# Altium project Jog3K_Controller.PrjPCB
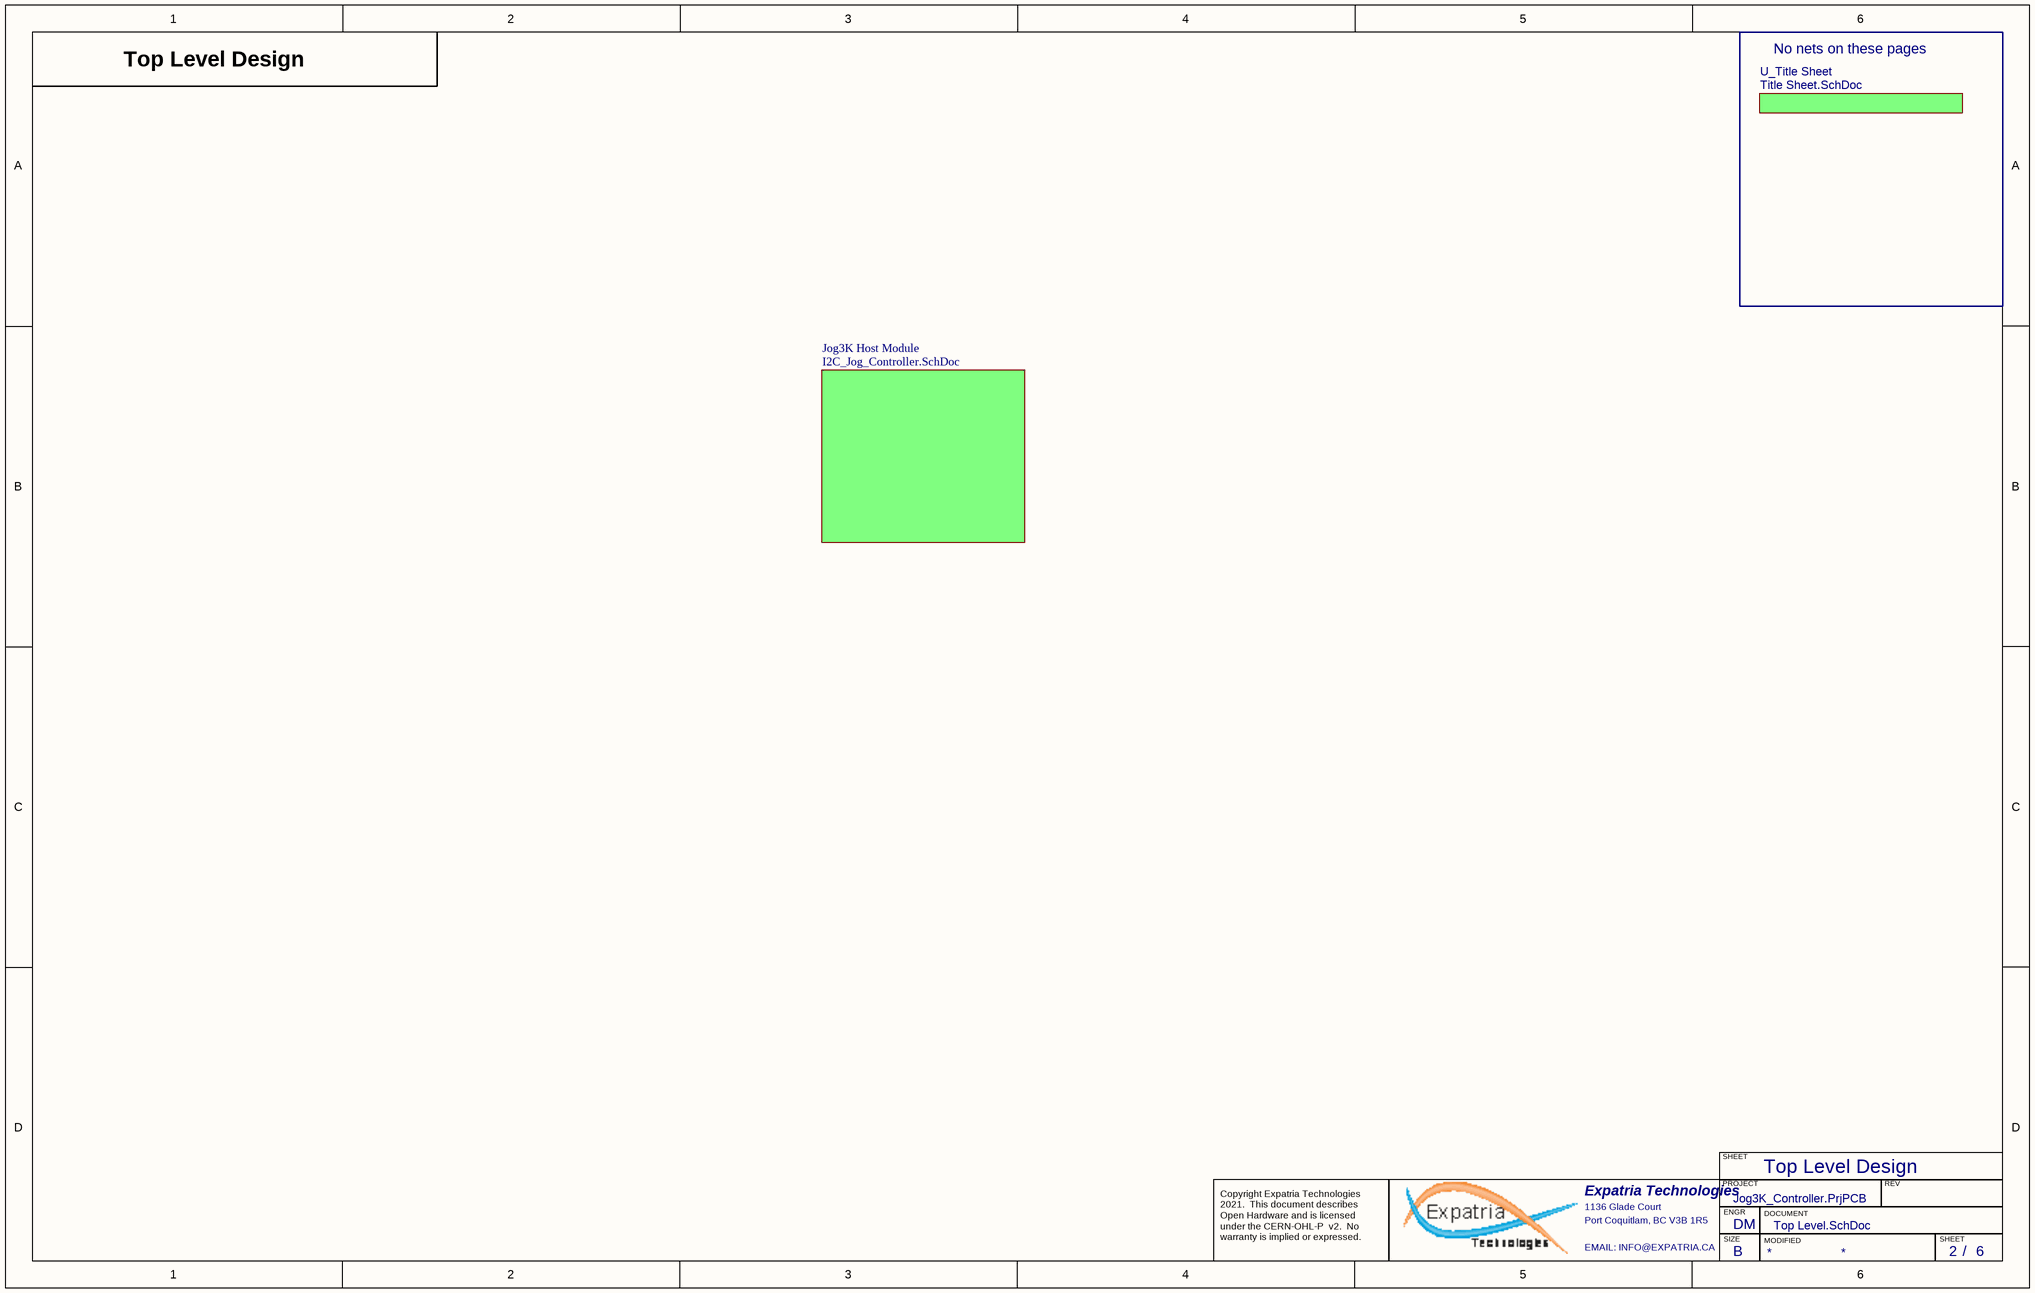
[diagram p0: Top Level.SchDoc]
VarRevNo: A3; Title: Jog3K; PCBREVNO: A3; PCBPARTNO: Jog3K
7 sheets, 150 parts. Net scope: hierarchical (ports join the sheet entries above them; power ports are global).
Board file: I2C_Jog_Controller.pcbdoc
Sheets:
  Top Level.SchDoc
    U_Title Sheet = Title Sheet.SchDoc
    Jog3K Host Module = I2C_Jog_Controller.SchDoc
      SL1 = PushButtonside.SchDoc
      LT = PushButtonQuadrant.SchDoc
      SL2 = PushButtonside.SchDoc
      UP = PushButtonQuadrant.SchDoc
      DN = PushButtonQuadrant.SchDoc
      RT = PushButtonQuadrant.SchDoc
      RI = PushButtonQuadrant.SchDoc
      LW = PushButtonQuadrant.SchDoc
      SPN = PushButtonBlack.SchDoc
      HME = PushButtonBlack.SchDoc
      SOVR = 12mm_rotary_knob.SchDoc
      FOVR = 12mm_rotary_knob.SchDoc
      FLD = PushButtonBlack.SchDoc
      MST = PushButtonBlack.SchDoc
      CYC = PushButtonBlack.SchDoc
      FHL = PushButtonBlack.SchDoc
      HLT = PushButtonBlack.SchDoc

## Sheet Top Level.SchDoc: Jog3K
size B; Author: DM; CompanyName: Silver Bullet Technology LLC; DrawnBy: D.McIntire; Engineer: DM; Organization: Silver Bullet Technology; Address1: Schematic; Address2: 5300 Via Andrea; Address3: Newbury Park, CA 91320; Address4: USA; DocumentNumber: 2; Revision: A3; SheetNumber: 2; SheetTotal: 6; PCB_Rev: A3

### Sub-sheets
Jog3K Host Module = I2C_Jog_Controller.SchDoc: no entries
U_Title Sheet = Title Sheet.SchDoc: no entries

### Notes on the sheet
- Top Level Design
- No nets on these pages
- SHEET
- Expatria Technologies
- 1136 Glade Court
- Port Coquitlam, BC V3B 1R5
- PROJECT
- SIZE
- ENGR
- MODIFIED
- DOCUMENT
- REV
- Copyright Expatria Technologies 2021.  This document describes Open Hardware and is licensed under the CERN-OHL-P  v2.  No warranty is implied or expressed.
- EMAIL: INFO@EXPATRIA.CA
- B
- /

## Sheet Title Sheet.SchDoc: Bluebell MFG PCB
size B; Author: AM; CompanyName: Cambridge Mobile Telematics; DrawnBy: A.Marles; Engineer: DM; Organization: Silver Bullet Technology; Address1: Schematic; Address2: 101 Main Street, 14th Floor; Address3: Cambridge, MA 02142; Address4: USA; DocumentNumber: 1; Revision: A3; SheetNumber: 1; SheetTotal: 6
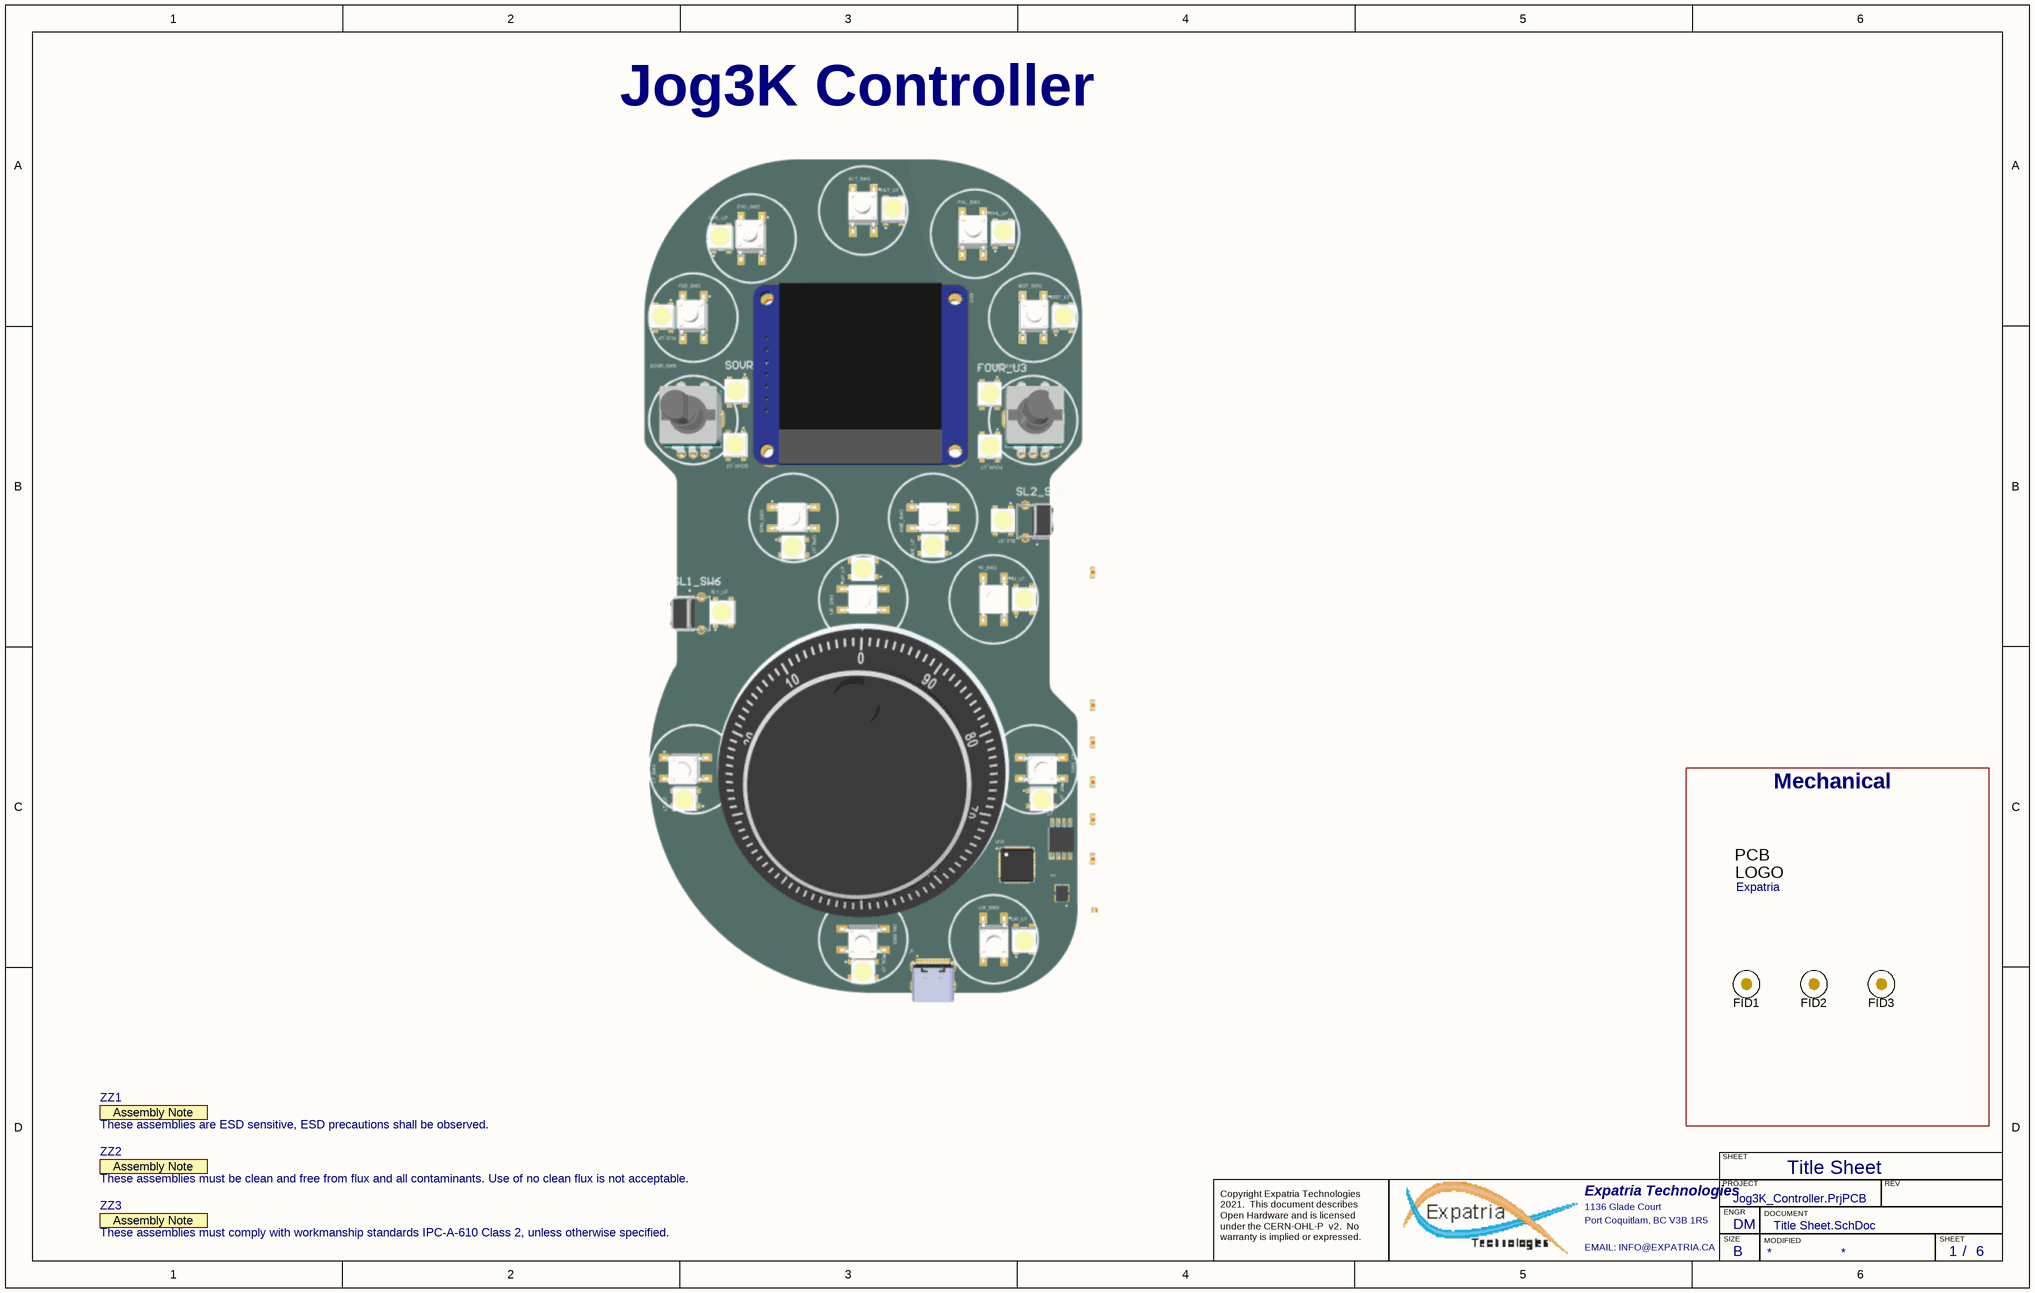
[diagram p1: Title Sheet.SchDoc]

### Parts
FID1  Fiducial  [Fiducial10-20]  (value not drawn)  (no BOM)
FID2  Fiducial  [Fiducial10-20]  (value not drawn)  (no BOM)
FID3  Fiducial  [Fiducial10-20]  (value not drawn)  (no BOM)
Logo1  Expatria  [Expatria-Logo]  (no BOM)
ZZ1  These assemblies are ESD sensitive, ESD precautions shall be observed.  [AssemblyNote]  (graphical)
ZZ2  These assemblies must be clean and free from flux and all contaminants. Use of no clean flux is not acceptable.  [AssemblyNote]  (graphical)
ZZ3  These assemblies must comply with workmanship standards IPC-A-610 Class 2, unless otherwise specified.  [AssemblyNote]  (graphical)

### Blocks framed on the sheet
Mechanical: FID1-FID3 Logo1

### Notes on the sheet
- Jog3K Controller
- Title Sheet
- SHEET
- Expatria Technologies
- 1136 Glade Court
- Port Coquitlam, BC V3B 1R5
- PROJECT
- SIZE
- ENGR
- MODIFIED
- DOCUMENT
- REV
- Copyright Expatria Technologies 2021.  This document describes Open Hardware and is licensed under the CERN-OHL-P  v2.  No warranty is implied or expressed.
- EMAIL: INFO@EXPATRIA.CA
- B
- /
- (in symbol AssemblyNote) Assembly Note
- (in symbol SBT-Logo) PCB; LOGO

### Library data of the parts
FID1-FID3 = Fiducial: FIDUCIAL NO ASSEMBLY; Manufacturer 1: NONE; Manufacturer Part Number 1: NONE; Value: Fiducial
Logo1 = SBT-Logo: Expatria Logo; Manufacturer 1: NONE; Value: SBT LOGO; Manufacturer Part Number 1: NONE
ZZ1-ZZ3 = AssemblyNote: SymbolCreator: codlsc; SymbolVersion: 2010-05-18; CompType: AssemblyNote; ClassName: AssemblyNote; Publisher: Texas Instruments; LatestRevisionDate: 2012-06-14; LatestRevisionNote: Initial Version; Alternate Manufacturer: -; Alternate PartNumber: -

## Sheet I2C_Jog_Controller.SchDoc: Bluebell MFG PCB
size C; Author: AM; CompanyName: Cambridge Mobile Telematics; DrawnBy: A.Marles; Engineer: DM; Organization: Silver Bullet Technology; Address1: Schematic; Address2: 101 Main Street, 14th Floor; Address3: Cambridge, MA 02142; Address4: USA; DocumentNumber: 3; Revision: A3; SheetNumber: 3; SheetTotal: 6
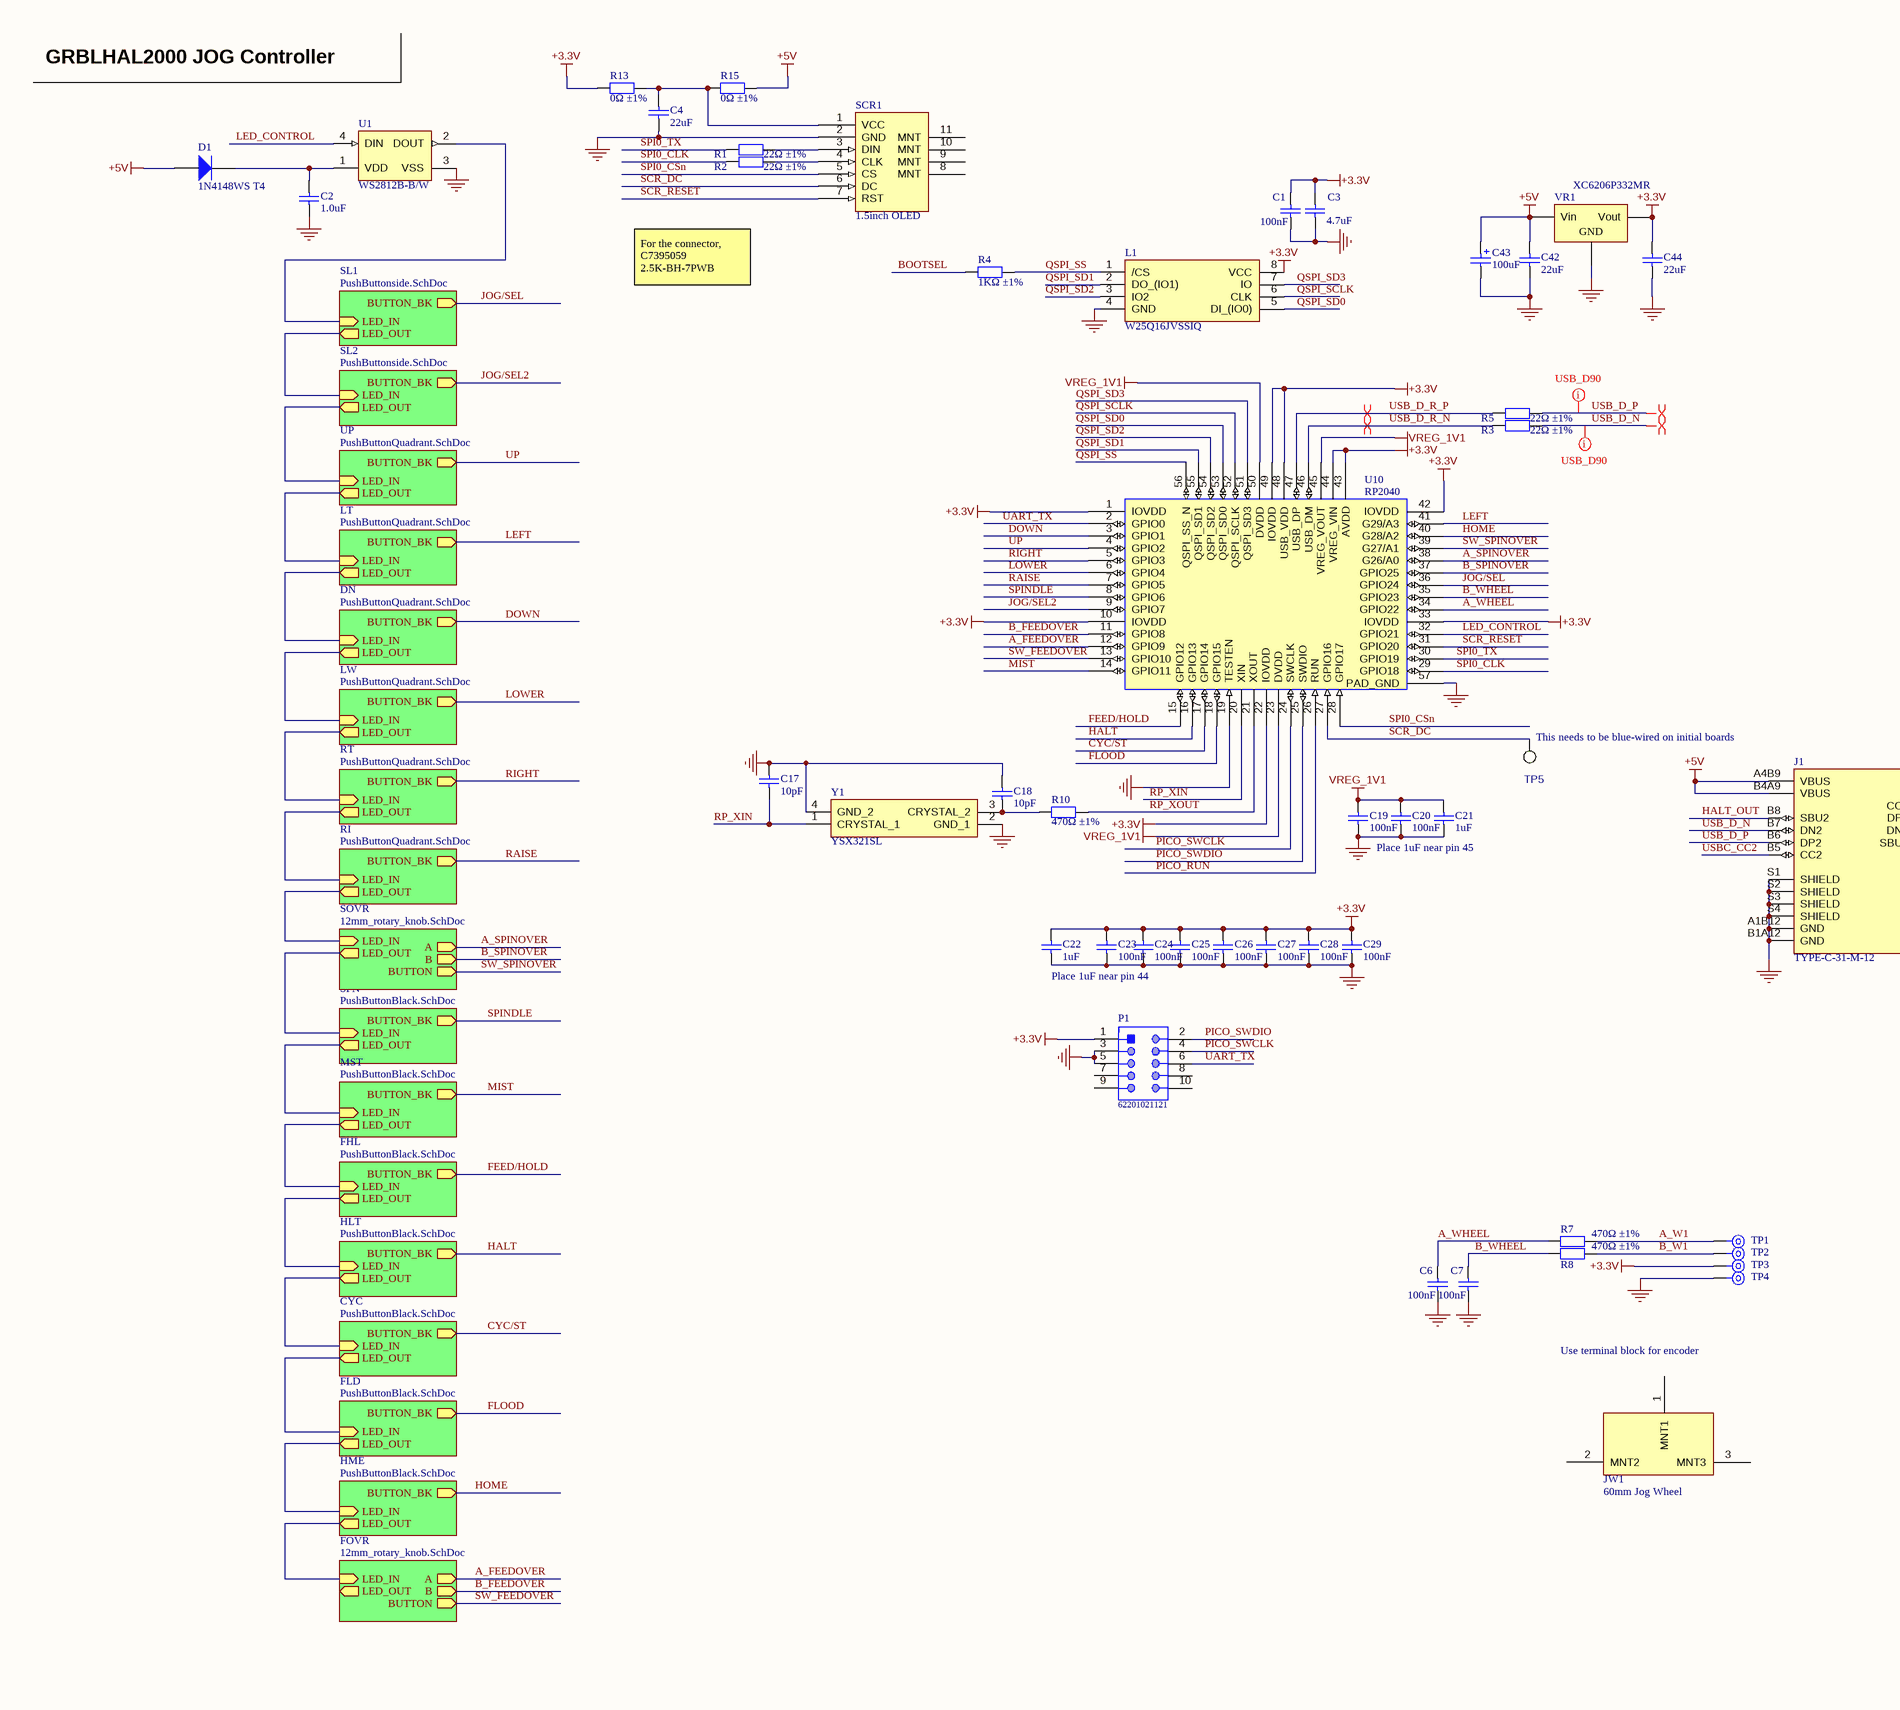
[diagram p2: I2C_Jog_Controller.SchDoc, left]
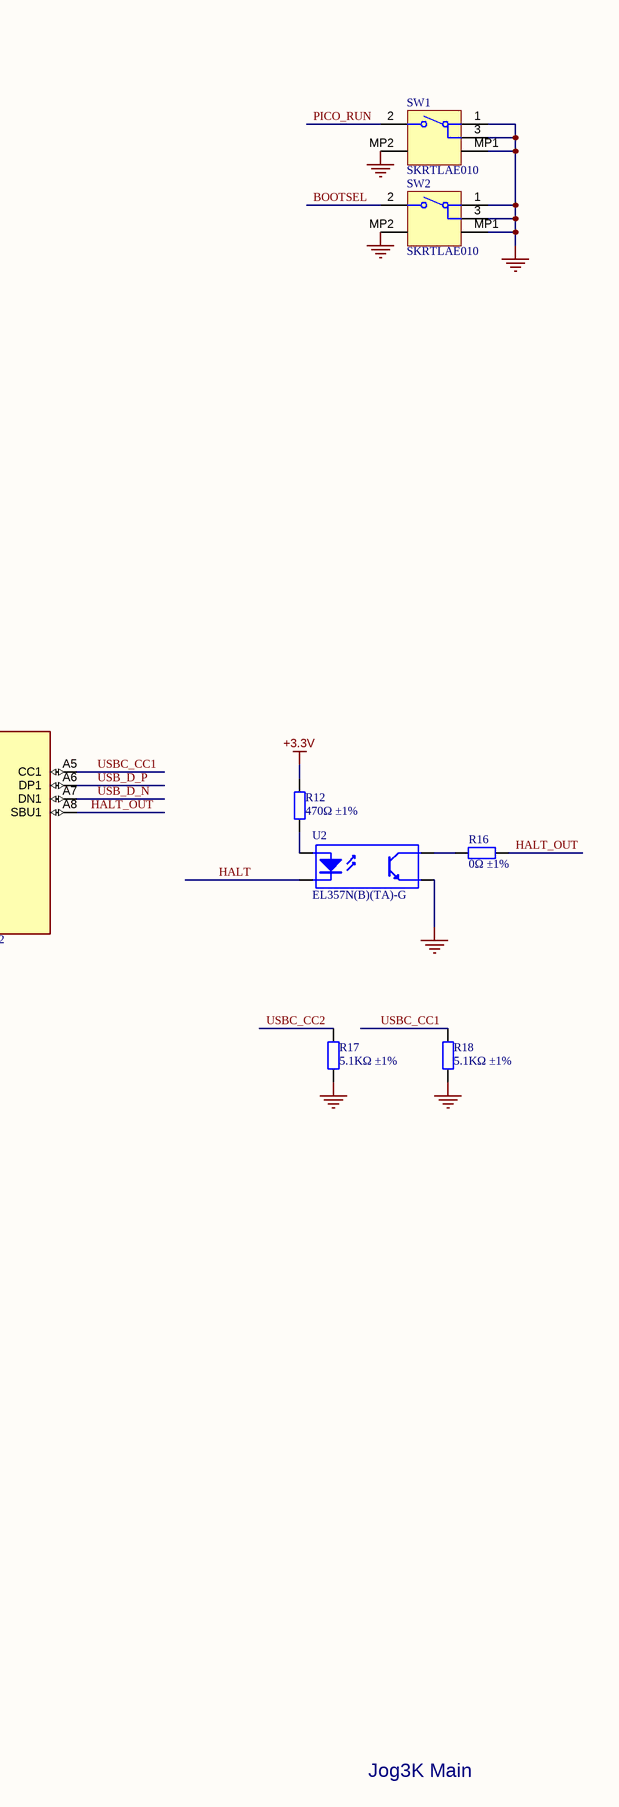
[diagram p3: I2C_Jog_Controller.SchDoc, right]

### Parts
C1  100nF  [0603_C]
C2  1.0uF  [0402_C]
C3  4.7uF  [0603_C]
C4  22uF  [0805_C]
C6  100nF  [0603_C]
C7  100nF  [0603_C]
C17  10pF  [0603_C]
C18  10pF  [0603_C]
C19  100nF  [0603_C]
C20  100nF  [0603_C]
C21  1uF  [0603_C]
C22  1uF  [0603_C]
C23  100nF  [0603_C]
C24  100nF  [0603_C]
C25  100nF  [0603_C]
C26  100nF  [0603_C]
C27  100nF  [0603_C]
C28  100nF  [0603_C]
C29  100nF  [0603_C]
C42  22uF  [0805_C]
C43  100uF  [CASE-B_3528]
C44  22uF  [0805_C]
D1  1N4148WS T4  [SOD-323]
J1  TYPE-C-31-M-12  [HRO_TYPE-C-31-M-12]
JW1  60mm Jog Wheel  [60mm_Jog_wheel]
L1  W25Q16JVSSIQ  [SOIC127P780X195-8N]
P1  62201021121  [62201021121]  (no BOM)
R1  22Ω ±1%  [0603_R]
R2  22Ω ±1%  [0603_R]
R3  22Ω ±1%  [0603_R]
R4  1KΩ ±1%  [0603_R]
R5  22Ω ±1%  [0603_R]
R7  470Ω ±1%  [0603_R]
R8  470Ω ±1%  [0603_R]
R10  470Ω ±1%  [0603_R]
R12  470Ω ±1%  [0603_R]
R13  0Ω ±1%  [0603_R]
R15  0Ω ±1%  [0603_R]  (no BOM)
R16  0Ω ±1%  [0603_R]  (no BOM)
R17  5.1KΩ ±1%  [0603_R]
R18  5.1KΩ ±1%  [0603_R]
SCR1  1.5inch OLED  [1.5inch_Waveshare_OLED]  (no BOM)
SW1  SKRTLAE010  [ALPS-SKRTLAE010_V]
SW2  SKRTLAE010  [ALPS-SKRTLAE010_V]
TP1  2.5mm TP  [TP_SQ_2.5mm]  (value not drawn)  (no BOM)
TP2  2.5mm TP  [TP_SQ_2.5mm]  (value not drawn)  (no BOM)
TP3  2.5mm TP  [TP_SQ_2.5mm]  (value not drawn)  (no BOM)
TP4  2.5mm TP  [TP_SQ_2.5mm]  (value not drawn)  (no BOM)
TP5  TESTPOINT  [TP/SMALL]  (value not drawn)  (no BOM)
U1  WS2812B-B/W  [ADA-RGB-1655_V]
U2  EL357N(B)(TA)-G  [SOP-4_P2.54]
U10  RP2040  [RP2040]
VR1  XC6206P332MR  [SOT-23-3L]
Y1  YSX321SL  [YSX321SL]

### Sub-sheets
CYC = PushButtonBlack.SchDoc: BUTTON_BK (out), LED_IN (in), LED_OUT (out)
DN = PushButtonQuadrant.SchDoc: BUTTON_BK (out), LED_OUT (out), LED_IN (in)
FHL = PushButtonBlack.SchDoc: BUTTON_BK (out), LED_IN (in), LED_OUT (out)
FLD = PushButtonBlack.SchDoc: BUTTON_BK (out), LED_OUT (out), LED_IN (in)
FOVR = 12mm_rotary_knob.SchDoc: LED_OUT (out), LED_IN (in), A (out), B (out), BUTTON (out)
HLT = PushButtonBlack.SchDoc: BUTTON_BK (out), LED_IN (in), LED_OUT (out)
HME = PushButtonBlack.SchDoc: BUTTON_BK (out), LED_IN (in), LED_OUT (out)
LT = PushButtonQuadrant.SchDoc: BUTTON_BK (out), LED_IN (in), LED_OUT (out)
LW = PushButtonQuadrant.SchDoc: BUTTON_BK (out), LED_OUT (out), LED_IN (in)
MST = PushButtonBlack.SchDoc: BUTTON_BK (out), LED_OUT (out), LED_IN (in)
RI = PushButtonQuadrant.SchDoc: BUTTON_BK (out), LED_OUT (out), LED_IN (in)
RT = PushButtonQuadrant.SchDoc: BUTTON_BK (out), LED_IN (in), LED_OUT (out)
SL1 = PushButtonside.SchDoc: BUTTON_BK (out), LED_OUT (out), LED_IN (in)
SL2 = PushButtonside.SchDoc: BUTTON_BK (out), LED_OUT (out), LED_IN (in)
SOVR = 12mm_rotary_knob.SchDoc: LED_OUT (out), LED_IN (in), A (out), B (out), BUTTON (out)
SPN = PushButtonBlack.SchDoc: BUTTON_BK (out), LED_IN (in), LED_OUT (out)
UP = PushButtonQuadrant.SchDoc: BUTTON_BK (out), LED_IN (in), LED_OUT (out)

### Nets
+3.3V: C1.2 C3.2 C22.2 C23.2 C24.2 C25.2 C26.2 C27.2 C28.2 C29.2 C44.2 L1.8(VCC) P1.1 R12.2 R13.2 TP3.1 U10.1(IOVDD) U10.10(IOVDD) U10.22(IOVDD) U10.33(IOVDD) U10.42(IOVDD) U10.43(AVDD) U10.44(VREG_VIN) U10.48(USB_VDD) U10.49(IOVDD) VR1.2(Vout)
+5V: C42.2 C43.1 D1.1(A) J1.A4B9(VBUS) J1.B4A9(VBUS) R15.1 VR1.3(Vin)
GND: C1.1 C2.1 C3.1 C4.1 C6.1 C7.1 C17.2 C18.2 C19.1 C20.1 C21.1 C22.1 C23.1 C24.1 C25.1 C26.1 C27.1 C28.1 C29.1 C42.1 C43.2 C44.1 J1.A1B12(GND) J1.B1A12(GND) J1.S1(SHIELD) J1.S2(SHIELD) J1.S3(SHIELD) J1.S4(SHIELD) L1.4(GND) P1.3 P1.5 R17.2 R18.2 SCR1.2(GND) SW1.1 SW1.3 SW1.MP1 SW1.MP2 SW2.1 SW2.3 SW2.MP1 SW2.MP2 TP4.1 U1.3(VSS) U2.3(E) U10.19(TESTEN) U10.57(PAD_GND) VR1.1(GND) Y1.2(GND_1) Y1.4(GND_2)
VREG_1V1: C19.2 C20.2 C21.2 U10.23(DVDD) U10.45(VREG_VOUT) U10.50(DVDD)
A_FEEDOVER: U10.12(GPIO9) ; sheet FOVR/A
A_SPINOVER: U10.38(G26/A0) ; sheet SOVR/A
A_W1: R7.2 TP1.1
A_WHEEL: C6.2 R7.1 U10.34(GPIO22)
B_FEEDOVER: U10.11(GPIO8) ; sheet FOVR/B
B_SPINOVER: U10.37(GPIO25) ; sheet SOVR/B
B_W1: R8.2 TP2.1
B_WHEEL: C7.2 R8.1 U10.35(GPIO23)
BOOTSEL: R4.1 SW2.2
CYC/ST: U10.17(GPIO14) ; sheet CYC/BUTTON_BK
DOWN: U10.3(GPIO1) ; sheet DN/BUTTON_BK
FEED/HOLD: U10.15(GPIO12) ; sheet FHL/BUTTON_BK
FLOOD: U10.18(GPIO15) ; sheet FLD/BUTTON_BK
HALT: U2.2(K) U10.16(GPIO13) ; sheet HLT/BUTTON_BK
HALT_OUT: J1.A8(SBU1) J1.B8(SBU2) R16.1
HOME: U10.40(G28/A2) ; sheet HME/BUTTON_BK
JOG/SEL: U10.36(GPIO24) ; sheet SL1/BUTTON_BK
JOG/SEL2: U10.9(GPIO7) ; sheet SL2/BUTTON_BK
LED_CONTROL: U1.4(DIN) U10.32(GPIO21)
LED_IN: U1.2(DOUT) ; sheet SL1/LED_OUT, sheet SL1/LED_IN, sheet SL2/LED_OUT, sheet SL2/LED_IN, sheet UP/LED_IN
LED_IN: sheet LT/LED_OUT, sheet DN/LED_IN  [a separate net that carries the same name]
LED_IN: sheet LT/LED_IN, sheet UP/LED_OUT  [a separate net that carries the same name]
LED_IN: sheet DN/LED_OUT, sheet LW/LED_IN  [a separate net that carries the same name]
LED_IN: sheet RT/LED_OUT, sheet RI/LED_IN  [a separate net that carries the same name]
LED_IN: sheet RT/LED_IN, sheet LW/LED_OUT  [a separate net that carries the same name]
LED_IN: sheet RI/LED_OUT, sheet SOVR/LED_IN  [a separate net that carries the same name]
LED_IN: sheet SPN/LED_OUT, sheet MST/LED_IN  [a separate net that carries the same name]
LED_IN: sheet SPN/LED_IN, sheet SOVR/LED_OUT  [a separate net that carries the same name]
LED_IN: sheet HME/LED_OUT, sheet FOVR/LED_IN  [a separate net that carries the same name]
LED_IN: sheet HME/LED_IN, sheet FLD/LED_OUT  [a separate net that carries the same name]
LED_IN: sheet FLD/LED_IN, sheet CYC/LED_OUT  [a separate net that carries the same name]
LED_IN: sheet MST/LED_OUT, sheet FHL/LED_IN  [a separate net that carries the same name]
LED_IN: sheet CYC/LED_IN, sheet HLT/LED_OUT  [a separate net that carries the same name]
LED_IN: sheet FHL/LED_OUT, sheet HLT/LED_IN  [a separate net that carries the same name]
LEFT: U10.41(G29/A3) ; sheet LT/BUTTON_BK
LOWER: U10.6(GPIO4) ; sheet LW/BUTTON_BK
MIST: U10.14(GPIO11) ; sheet MST/BUTTON_BK
PICO_RUN: SW1.2 U10.26(RUN)
PICO_SWCLK: P1.4 U10.24(SWCLK)
PICO_SWDIO: P1.2 U10.25(SWDIO)
QSPI_SCLK: L1.6(CLK) U10.52(QSPI_SCLK)
QSPI_SD0: L1.5(DI_(IO0)) U10.53(QSPI_SD0)
QSPI_SD1: L1.2(DO_(IO1)) U10.55(QSPI_SD1)
QSPI_SD2: L1.3(IO2) U10.54(QSPI_SD2)
QSPI_SD3: L1.7(IO) U10.51(QSPI_SD3)
QSPI_SS: L1.1(/CS) R4.2 U10.56(QSPI_SS_N)
RAISE: U10.7(GPIO5) ; sheet RI/BUTTON_BK
RIGHT: U10.5(GPIO3) ; sheet RT/BUTTON_BK
RP_XIN: C17.1 U10.20(XIN) Y1.1(CRYSTAL_1)
RP_XOUT: R10.2 U10.21(XOUT)
SCR_DC: SCR1.6(DC) TP5.1 U10.27(GPIO16)
SCR_RESET: SCR1.7(RST) U10.31(GPIO20)
SPI0_CLK: R2.2 U10.29(GPIO18)
SPI0_CSn: SCR1.5(CS) U10.28(GPIO17)
SPI0_TX: R1.2 U10.30(GPIO19)
SPINDLE: U10.8(GPIO6) ; sheet SPN/BUTTON_BK
SW_FEEDOVER: U10.13(GPIO10) ; sheet FOVR/BUTTON
SW_SPINOVER: U10.39(G27/A1) ; sheet SOVR/BUTTON
UART_TX: P1.6 U10.2(GPIO0)
UP: U10.4(GPIO2) ; sheet UP/BUTTON_BK
USB_D_N: J1.A7(DN1) J1.B7(DN2) R3.1
USB_D_P: J1.A6(DP1) J1.B6(DP2) R5.1
USB_D_R_N: R3.2 U10.46(USB_DM)
USB_D_R_P: R5.2 U10.47(USB_DP)
USBC_CC1: J1.A5(CC1) R18.1
USBC_CC2: J1.B5(CC2) R17.1
NetC2_2: C2.2 D1.2(K) U1.1(VDD)
NetC4_2: C4.2 R13.1 R15.2 SCR1.1(VCC)
NetC18_1: C18.1 R10.1 Y1.3(CRYSTAL_2)
NetR1_1: R1.1 SCR1.3(DIN)
NetR2_1: R2.1 SCR1.4(CLK)
NetR12_1: R12.1 U2.1(A)
NetR16_2: R16.2 U2.4(C)

Not connected (* = marked no-connect by the designer): JW1 1(MNT1) 2(MNT2) 3(MNT3); P1 7 8 9 10; SCR1 8(MNT) 9(MNT) 10(MNT) 11(MNT)

### Layout directives
differential pair: USB_D_N, USB_D_P, USB_D_R_N, USB_D_R_P
net class USB_D90: USB_D_N, USB_D_P

### Notes on the sheet
- GRBLHAL2000 JOG Controller
- For the connector,
  C7395059
  2.5K-BH-7PWB
- (near TP5) This needs to be blue-wired on initial boards
- Place 1uF near pin 45
- Place 1uF near pin 44
- Use terminal block for encoder
- Jog3K Main
- Expatria Technologies
- SHEET
- PROJECT
- REV
- 1136 Glade Court
- Port Coquitlam, BC V3B 1R5
- EMAIL: INFO@EXPATRIA.CA
- SIZE
- ENGR
- C
- MODIFIED
- DOCUMENT
- /
- Copyright Expatria Technologies 2021.  This document describes Open Hardware and is licensed under the CERN-OHL-P  v2.  No warranty is implied or expressed.

### Library data of the parts
C1 C6 C7 C19 C20 C23-C29 = 0603 100nF (104) 10% 50V: Chip capacitors; Manufacturer: YAGEO; PartNumber: CC0603KRX7R9BB104; Tolerance: 10%; Voltage: 50V; ComponentLink1Description: Supplier link; ComponentLink1URL: http://www.szlcsc.com/product/details_15331.html; Package: 0603; Supplier: LC; SuppliersPartNumber: C14663; Capacitance: 100nF
C2 = 0402 1.0uF (105) 10% 25V: Chip capacitor; Manufacturer: Samsung Electro-Mechanics; PartNumber: CL05A105KA5NQNC; Capacitance: 1uF; Tolerance: 10%; Voltage: 25V; ComponentLink1Description: Supplier link; ComponentLink1URL: http://www.szlcsc.com/product/details_53938.html; Package: 0402; Supplier: LC; SuppliersPartNumber: C52923
C3 = 0603 4.7uF (475) 10% 16V: Chip capacitors; Manufacturer: Samsung Electro-Mechanics; PartNumber: CL10A475KO8NNNC; Tolerance: 10%; Voltage: 16V; ComponentLink1Description: Supplier link; ComponentLink1URL: http://www.szlcsc.com/product/details_20375.html; Package: 0603; Supplier: LC; SuppliersPartNumber: C19666; Capacitance: 4.7uF
C4 C42 C44 = 0805 22uF (226) 20% 25V: Chip capacitors; Manufacturer: Samsung Electro-Mechanics; PartNumber: CL21A226MAQNNNE; Tolerance: 20%; Voltage: 25V; ComponentLink1Description: Supplier link; ComponentLink1URL: http://www.szlcsc.com/product/details_46786.html; Package: 0805; Supplier: LC; SuppliersPartNumber: C45783; Capacitance: 22uF
C17 C18 = 0603 10pF (100) 5% 50V: Chip capacitors; Manufacturer: Samsung Electro-Mechanics; PartNumber: CL10C100JB8NNNC; Tolerance: 5%; Voltage: 50V; ComponentLink1Description: Supplier link; ComponentLink1URL: http://www.szlcsc.com/product/details_1986.html; Package: 0603; Supplier: LC; SuppliersPartNumber: C1634; Capacitance: 10pF
C21 C22 = 0603 1uF (105) 10% 50V: Chip capacitors; Manufacturer: Samsung Electro-Mechanics; PartNumber: CL10A105KB8NNNC; Tolerance: 10%; Voltage: 50V; ComponentLink1Description: Supplier link; ComponentLink1URL: http://www.szlcsc.com/product/details_16531.html; Package: 0603; Supplier: LC; SuppliersPartNumber: C15849; Capacitance: 1uF
C43 = 3528 100uF (107) 10% 6.3V: Tantalum capacitor; Manufacturer: AVX; PartNumber: TAJB107K006RNJ; Tolerance: 10%; Voltage: 6.3V; ComponentLink1Description: Supplier link; ComponentLink1URL: http://www.szlcsc.com/product/details_16815.html; Package: 3528; Supplier: LC; SuppliersPartNumber: C16133; Capacitance: 100uF
D1 = SOD-323 1N4148WS T4: 二极管; ComponentLink1Description: 供应商链接; ComponentLink1URL: http://www.szlcsc.com/product/details_2485.html; Package: SOD-323; Supplier: LC; SuppliersPartNumber: C2128
J1 = TYPE-C-31-M-12: USB Connectors 24 Receptacle 1 8.94*7.3mm RoHS; MF: HRO Electronics Co., Ltd.; Value: *; SnapEDA_Link: https://www.snapeda.com/parts/TYPE-C-31-M-12/HRO%20Electronics%20Co.,%20Ltd./view-part/3228496/?ref=snap; Package: Package; MP: TYPE-C-31-M-12; Price: None; Availability: Unavailable; SuppliersPartNumber: C165948
JW1 = 60mm_Jog_Wheel
L1 = W25Q128JVSIQ_TR: SPI NOR FLASH 16Mbit; Manufacturer_Name: Winbond; Datasheet Link: http://www.winbond.com/resource-files/w25q128jv%20spi%20revc%2011162016.pdf; Height: 1.95mm; Manufacturer_Part_Number: W25Q16JVSSIQ; SuppliersPartNumber: C82317
P1 = CMP-1502-00948-1: THT Vertical Pin Header WR-PHD, Pitch 1.27 mm, Dual Row, 10 pins; Manufacturer: Wurth Elektronik; Rated Current: 1A; Pin Number: 10; Working Voltage: 100VAC; Contact Resistance: 20mOhm; Withstanding Voltage: 500VAC; Pitch: 1.27mm; Gender: Male; Mounting Technology: THT; Manufacturer URL: http://www.we-online.de; Package Reference: 62201021121; Row Number: Dual; Datasheet URL: https://katalog.we-online.de/em/datasheet/62201021121.pdf; Publisher: WurthElektronik; Packaging: Box; Operating Temperature: -40to105degC; Orientation: Vertical; Part Number: 62201021121
R1-R3 R5 = 0603 22R (22R0) 1%: Chip resistor; Manufacturer: Uniroyal Elec; PartNumber: 0603WAF220JT5E; Power: 1/10W; ComponentLink1Description: Supplier link; ComponentLink1URL: http://www.szlcsc.com/product/details_24078.html; Package: 0603; Supplier: LC; SuppliersPartNumber: C23345; Resistance: 22Ω; Tolerance: 1%
R4 = 0603 1K (1001) 1%: Chip resistor; Manufacturer: Uniroyal Elec; PartNumber: 0603WAF1001T5E; Power: 1/10W; ComponentLink1Description: Supplier link; ComponentLink1URL: http://www.szlcsc.com/product/details_21904.html; Package: 0603; Supplier: LC; SuppliersPartNumber: C21190; Resistance: 1KΩ; Tolerance: 1%
R7 R8 R10 R12 = 0603 470R (4700) 1%: Chip resistor; Manufacturer: Uniroyal Elec; PartNumber: 0603WAF4700T5E; Power: 1/10W; ComponentLink1Description: Supplier link; ComponentLink1URL: http://www.szlcsc.com/product/details_23906.html; Package: 0603; Supplier: LC; SuppliersPartNumber: C23179; Resistance: 470Ω; Tolerance: 1%
R13 R15 R16 = 0603 0R (0R0) 1%: Chip resistor; Manufacturer: Uniroyal Elec; PartNumber: 0603WAF0000T5E; Power: 1/10W; ComponentLink1Description: Supplier link; ComponentLink1URL: http://www.szlcsc.com/product/details_21903.html; Package: 0603; Supplier: LC; SuppliersPartNumber: C21189; Resistance: 0Ω; Tolerance: 1%
R17 R18 = 0603 5.1K (5101) 1%: Chip resistor; Manufacturer: Uniroyal Elec; PartNumber: 0603WAF5101T5E; Power: 1/10W; ComponentLink1Description: Supplier link; ComponentLink1URL: http://www.szlcsc.com/product/details_23913.html; Package: 0603; Supplier: LC; SuppliersPartNumber: C23186; Resistance: 5.1KΩ; Tolerance: 1%
SCR1 = 1.5inch Waveshare OLED screen: SuppliersPartNumber: C2897370
SW1 SW2 = CMP-2000-07073-2: Side Push Type, 250 V, -40 to 90 degC, 3-Pin SMD, RoHS, Tape and Reel; Manufacturer: ALPS; Operating Force: 1.6N; Folder: Unified Components\Components\New Releases\New\; Maximum Current Rating: 0.05@12VDCA; RevisionId: 1; Pole Throw Configuration: SPST; Switch Configuration: N.O.; AccessRights: 2147483647; Maximum DC Voltage Rating: 12V; ContentType: Unified Component; Rad Hard: No; Mounting: SurfaceMount; Datasheet URL: http://www.alps.com/prod/info/E/PDF/Tact/SurfaceMount/SKRT/SKRT.PDF; Manufacturer URL: http://www.alps.com/e/; ReleaseDate: 22/09/2017 06:13:25 AM; ItemHRID: CMP-2000-07073; ContentTypeGUID: CB3C11C4-E317-11DF-B822-12313F0024A2; LifeCycle: Released; ItemGUID: EAC55BEC-37DC-4BDB-8BA7-D75E6D5C3D75; Packaging: Tape&Reel; Package Reference: SKRTLAE010; FolderGUID: B7F4506A-9127-42E7-A087-46FE7B18D116; Datasheet Version: 06/2015; Mounting Technology: SurfaceMount; LifeCycleStateGUID: 61E382EE-6656-4F12-9E24-BE9327104A25; Package Description: 3-Pin Surface Mount Device, Body 4.5 x 3.55 mm, Pitch 1.225 mm; SuppliersPartNumber: C110293; Manufacturer 1: ALPS
TP1-TP4 = TL_5017: 2.5mm x 3.5mm pad; Manufacturer 1: Keystone Electronics; Manufacturer Part Number 1: 5017; Number of Ports: 1; Value: Test Loop; Supplier 1: Digi-Key; Supplier Part Number 1: 36-5017CT-ND; Stock 1: 203311; Pricing 1: 1 = 0.47000, 10 = 0.44100, 25 = 0.37800, 50 = 0.32140, 100 = 0.30880, 250 = 0.27732, 500 = 0.26472, 1000 = 0.22061, 2500 = 0.20170 (USD); RoHS: Yes; Mount: Surface Mount; Color: White; Contact Plating: Tin; Contact Material: Bronze; Material: Bronze; Package Quantity: 5000; Packaging: Tape and Reel; Termination: Solder; Orientation: Straight; Length: 2.66mm; Depth: 1.01mm; REACH SVHC: No SVHC; Lead Free: Lead Free; ComponentLink1URL: https://datasheet.ciiva.com/18456/5017-18456885.pdf?src-supplier=Digi-Key; ComponentLink1Description: https://datasheet.ciiva.com/18456/5017-18456885.pdf?src-supplier=Digi-Key; ComponentLink2URL: https://datasheet.ciiva.com/18456/5017-18456886.pdf?src-supplier=Digi-Key; ComponentLink2Description: https://datasheet.ciiva.com/18456/5017-18456886.pdf?src-supplier=Digi-Key; ComponentLink3URL: https://datasheet.ciiva.com/18456/5017-18456887.pdf?src-supplier=Digi-Key; ComponentLink3Description: https://datasheet.ciiva.com/18456/5017-18456887.pdf?src-supplier=Digi-Key
TP5 = TESTPOINT: Test Point; Manufacturer 1: N/A; Manufacturer Part Number 1: N/A; Value: Testpoint; Manufacturer: N/A; Manufacturer Part Number: N/A
U1 = CMP-2000-05026-1: Intelligent Control LED Integrated Light Source, 3.5 to 5.3 V, -25 to 80 degC, 4-Pin SMD, RoHS, Tape and Reel; Manufacturer: Worldsemi; Package Description: 4-Pin Surface Mount Device, Body 5 x 5 mm; SuppliersPartNumber: C2874885; Part_Number: WS2812B-B/W
U2 = EL357N(B)(TA)-G_[C6649]: OPTOISOLATOR 3.75KV TRANS 4-SOP; Manufacturer 1: Everlight Elec; ComponentLink1Description: 供应商链接; ComponentLink1URL: http://www.szlcsc.com/product/details_7114.html; Package: SOP-4_P2.54; Supplier: LC; SuppliersPartNumber: C6649; Manufacturer Part Number 1: EL357N(B)(TA)-G
U10 = RP2040: RP2040 First MCU from RPI
VR1 = SOT-23 XC6206P332MR: 200mA 680mV@(100mA) Fixed 3.3V~3.3V Positive 1 6V SOT-23-3L Linear Voltage Regulators (LDO) ROHS; ComponentLink1Description: 供应商链接; ComponentLink1URL: http://www.szlcsc.com/product/details_5896.html; Package: SOT-23; Supplier: LC; SuppliersPartNumber: C5446
Y1 = YSX321SL: Crystal or Oscillator; Manufacturer_Name: YXC; Datasheet Link: https://datasheet.lcsc.com/szlcsc/YSX321SL-30MHZ-10PF-8PPM_C70576.pdf; Height: 0.8mm; Manufacturer_Part_Number: YSX321SL; SuppliersPartNumber: C9002

## Sheet PushButtonside.SchDoc: Jog3K
size B; DocumentNumber: 5; SheetNumber: 5; SheetTotal: 6
Used 2 times, as channels Jog3K Host Module/SL1, Jog3K Host Module/SL2. Parts and nets are listed once, with the designators drawn on the sheet.
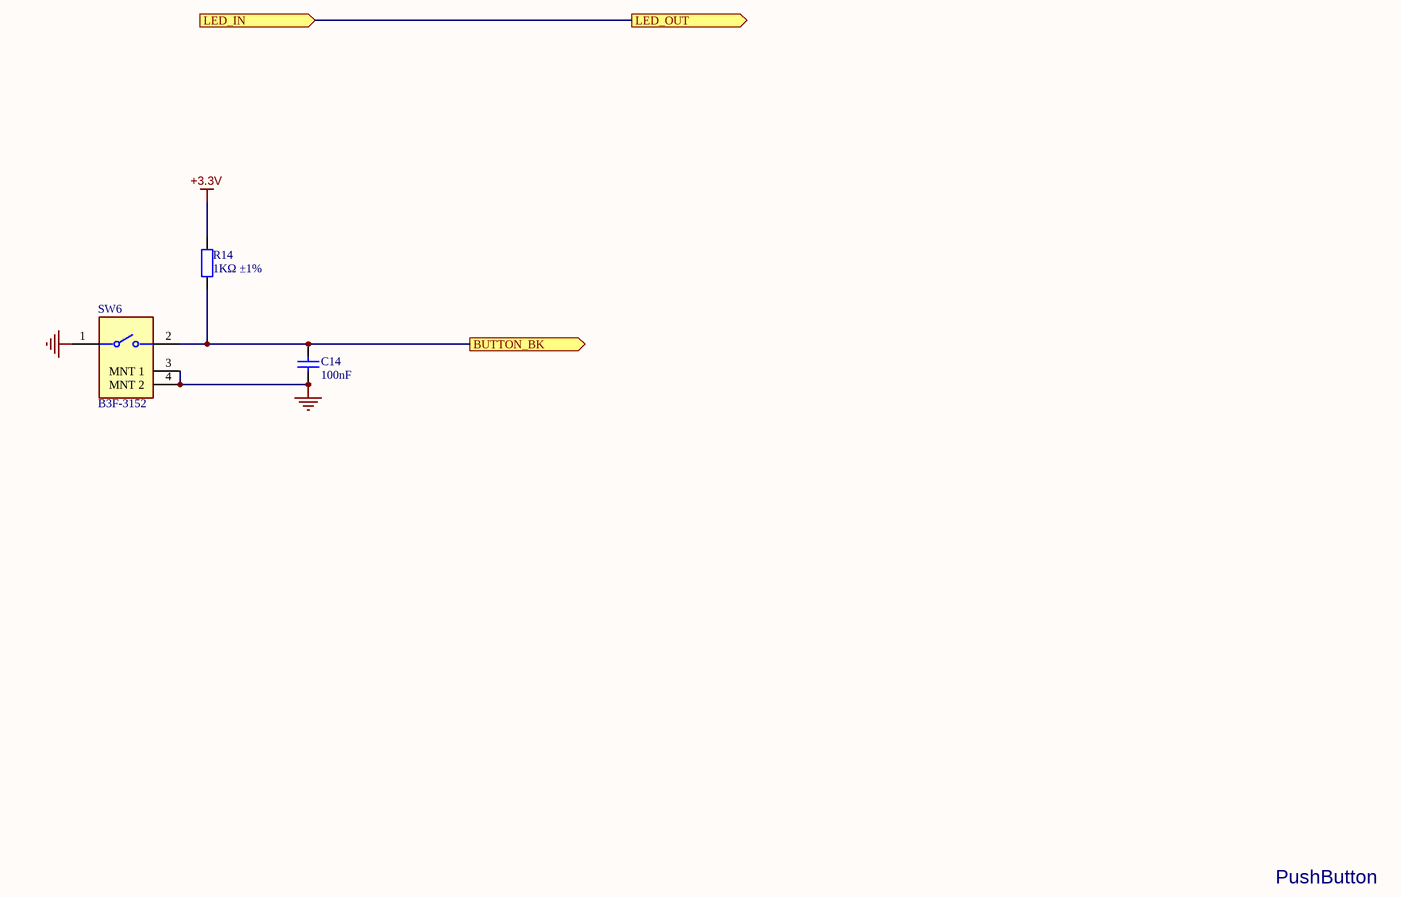
[diagram p4: PushButtonside.SchDoc]

### Parts
C14  100nF  [0603_C]
R14  1KΩ ±1%  [0603_R]
SW6  B3F-3152  [FP-B3F-3152-MFG]

### Ports
BUTTON_BK (out), LED_IN (in), LED_OUT (out)

### Nets
+3.3V: R14.1
GND: C14.2 SW6.1 SW6.3(MNT_1) SW6.4(MNT_2)
BUTTON_BK: C14.1 R14.2 SW6.2 ; port BUTTON_BK
LED_IN: port LED_OUT, port LED_IN

### Channels
Jog3K Host Module/SL1: designators C14=SL1_C14 R14=SL1_R14 SW6=SL1_SW6; ports BUTTON_BK=JOG/SEL LED_IN=LED_IN LED_OUT=LED_IN
Jog3K Host Module/SL2: designators C14=SL2_C14 R14=SL2_R14 SW6=SL2_SW6; ports BUTTON_BK=JOG/SEL2 LED_IN=LED_IN LED_OUT=LED_IN

### Notes on the sheet
- PushButton
- SHEET
- Expatria Technologies
- 1136 Glade Court
- Port Coquitlam, BC V3B 1R5
- PROJECT
- SIZE
- ENGR
- MODIFIED
- DOCUMENT
- REV
- Copyright Expatria Technologies 2021.  This document describes Open Hardware and is licensed under the CERN-OHL-P  v2.  No warranty is implied or expressed.
- EMAIL: INFO@EXPATRIA.CA
- B
- /

### Library data of the parts
C14 = 0603 100nF (104) 10% 50V: as C1 on sheet I2C_Jog_Controller; ComponentLink1Description: Supplier link; ComponentLink1URL: http://www.szlcsc.com/product/details_15331.html; Package: 0603; Supplier: LC; SuppliersPartNumber: C14663; Capacitance: 100nF
R14 = 0603 1K (1001) 1%: as R4 on sheet I2C_Jog_Controller; ComponentLink1Description: Supplier link; ComponentLink1URL: http://www.szlcsc.com/product/details_21904.html; Package: 0603; Supplier: LC; SuppliersPartNumber: C21190; Resistance: 1KΩ; Tolerance: 1%
SW6 = CMP-08834-000033-1: SWITCH TACTILE SPST-NO 0.05A 24V; SuppliersPartNumber: C145896

## Sheet PushButtonQuadrant.SchDoc: Jog3K
size B; DocumentNumber: 5; SheetNumber: 5; SheetTotal: 6
Used 6 times, as channels Jog3K Host Module/LT, Jog3K Host Module/UP, Jog3K Host Module/DN, Jog3K Host Module/RT, Jog3K Host Module/RI, Jog3K Host Module/LW. Parts and nets are listed once, with the designators drawn on the sheet.
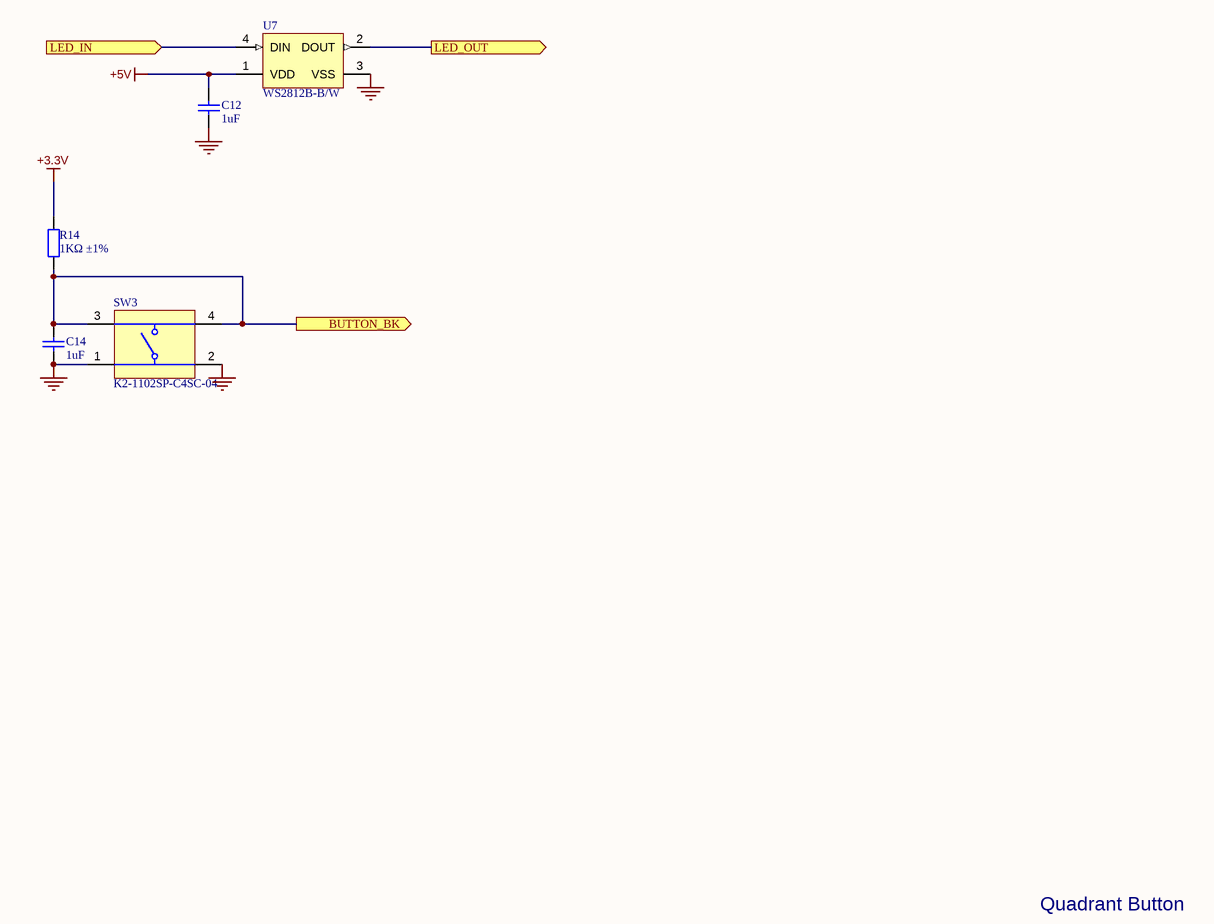
[diagram p5: PushButtonQuadrant.SchDoc]

### Parts
C12  1uF  [0603_C]
C14  1uF  [0603_C]
R14  1KΩ ±1%  [0603_R]
SW3  K2-1102SP-C4SC-04  [TECO-FSM4JSMATR_V]
U7  WS2812B-B/W  [ADA-RGB-1655_V]

### Ports
BUTTON_BK (out), LED_IN (in), LED_OUT (out)

### Nets
+3.3V: R14.1
+5V: C12.2 U7.1(VDD)
GND: C12.1 C14.2 SW3.1 SW3.2 U7.3(VSS)
BUTTON_BK: C14.1 R14.2 SW3.3 SW3.4 ; port BUTTON_BK
LED_IN: U7.4(DIN) ; port LED_IN
LED_OUT: U7.2(DOUT) ; port LED_OUT

### Channels
Jog3K Host Module/LT: designators C12=LT_C12 C14=LT_C14 R14=LT_R14 SW3=LT_SW3 U7=LT_U7; ports BUTTON_BK=LEFT LED_IN=LED_IN LED_OUT=LED_IN
Jog3K Host Module/UP: designators C12=UP_C12 C14=UP_C14 R14=UP_R14 SW3=UP_SW3 U7=UP_U7; ports BUTTON_BK=UP LED_IN=LED_IN LED_OUT=LED_IN
Jog3K Host Module/DN: designators C12=DN_C12 C14=DN_C14 R14=DN_R14 SW3=DN_SW3 U7=DN_U7; ports BUTTON_BK=DOWN LED_IN=LED_IN LED_OUT=LED_IN
Jog3K Host Module/RT: designators C12=RT_C12 C14=RT_C14 R14=RT_R14 SW3=RT_SW3 U7=RT_U7; ports BUTTON_BK=RIGHT LED_IN=LED_IN LED_OUT=LED_IN
Jog3K Host Module/RI: designators C12=RI_C12 C14=RI_C14 R14=RI_R14 SW3=RI_SW3 U7=RI_U7; ports BUTTON_BK=RAISE LED_IN=LED_IN LED_OUT=LED_IN
Jog3K Host Module/LW: designators C12=LW_C12 C14=LW_C14 R14=LW_R14 SW3=LW_SW3 U7=LW_U7; ports BUTTON_BK=LOWER LED_IN=LED_IN LED_OUT=LED_IN

### Notes on the sheet
- Quadrant Button
- SHEET
- Expatria Technologies
- 1136 Glade Court
- Port Coquitlam, BC V3B 1R5
- PROJECT
- SIZE
- ENGR
- MODIFIED
- DOCUMENT
- REV
- Copyright Expatria Technologies 2021.  This document describes Open Hardware and is licensed under the CERN-OHL-P  v2.  No warranty is implied or expressed.
- EMAIL: INFO@EXPATRIA.CA
- B
- /

### Library data of the parts
C12 C14 = 0603 1uF (105) 10% 50V: as C21 on sheet I2C_Jog_Controller; ComponentLink1Description: Supplier link; ComponentLink1URL: http://www.szlcsc.com/product/details_16531.html; Package: 0603; Supplier: LC; SuppliersPartNumber: C15849; Capacitance: 1uF
R14 = 0603 1K (1001) 1%: as R4 on sheet I2C_Jog_Controller; ComponentLink1Description: Supplier link; ComponentLink1URL: http://www.szlcsc.com/product/details_21904.html; Package: 0603; Supplier: LC; SuppliersPartNumber: C21190; Resistance: 1KΩ; Tolerance: 1%
SW3 = CMP-2000-07486-1: Top Actuated 50mA @ 12VDC Round Button SPST 6*6mm Tactile Switches ROHS; SuppliersPartNumber: C127509; Package: SMD-4_6.0x6.0x4.5P
U7 = CMP-2000-05026-1: as U1 on sheet I2C_Jog_Controller; Package Description: 4-Pin Surface Mount Device, Body 5 x 5 mm; SuppliersPartNumber: C2874885; Part_Number: WS2812B-B/W

## Sheet PushButtonBlack.SchDoc: Jog3K
size B; DocumentNumber: 5; SheetNumber: 5; SheetTotal: 6
Used 7 times, as channels Jog3K Host Module/SPN, Jog3K Host Module/HME, Jog3K Host Module/FLD, Jog3K Host Module/MST, Jog3K Host Module/CYC, Jog3K Host Module/FHL, Jog3K Host Module/HLT. Parts and nets are listed once, with the designators drawn on the sheet.
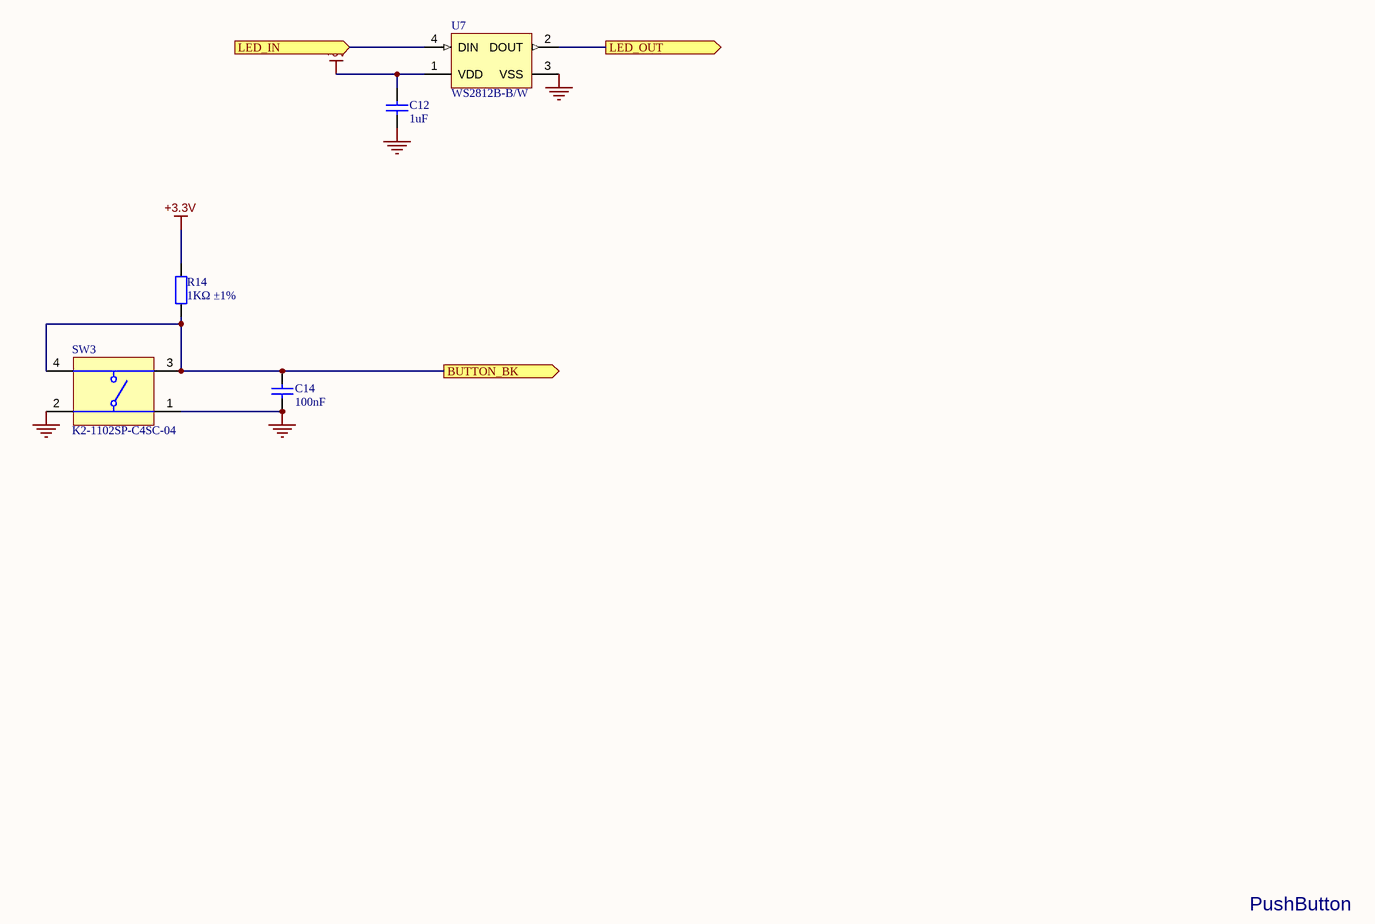
[diagram p6: PushButtonBlack.SchDoc]

### Parts
C12  1uF  [0603_C]
C14  100nF  [0603_C]
R14  1KΩ ±1%  [0603_R]
SW3  K2-1102SP-C4SC-04  [TECO-FSM4JSMATR_V]
U7  WS2812B-B/W  [ADA-RGB-1655_V]

### Ports
BUTTON_BK (out), LED_IN (in), LED_OUT (out)

### Nets
+3.3V: R14.1
+5V: C12.2 U7.1(VDD)
GND: C12.1 C14.2 SW3.1 SW3.2 U7.3(VSS)
BUTTON_BK: C14.1 R14.2 SW3.3 SW3.4 ; port BUTTON_BK
LED_IN: U7.4(DIN) ; port LED_IN
LED_OUT: U7.2(DOUT) ; port LED_OUT

### Channels
Jog3K Host Module/SPN: designators C12=SPN_C12 C14=SPN_C14 R14=SPN_R14 SW3=SPN_SW3 U7=SPN_U7; ports BUTTON_BK=SPINDLE LED_IN=LED_IN LED_OUT=LED_IN
Jog3K Host Module/HME: designators C12=HME_C12 C14=HME_C14 R14=HME_R14 SW3=HME_SW3 U7=HME_U7; ports BUTTON_BK=HOME LED_IN=LED_IN LED_OUT=LED_IN
Jog3K Host Module/FLD: designators C12=FLD_C12 C14=FLD_C14 R14=FLD_R14 SW3=FLD_SW3 U7=FLD_U7; ports BUTTON_BK=FLOOD LED_IN=LED_IN LED_OUT=LED_IN
Jog3K Host Module/MST: designators C12=MST_C12 C14=MST_C14 R14=MST_R14 SW3=MST_SW3 U7=MST_U7; ports BUTTON_BK=MIST LED_IN=LED_IN LED_OUT=LED_IN
Jog3K Host Module/CYC: designators C12=CYC_C12 C14=CYC_C14 R14=CYC_R14 SW3=CYC_SW3 U7=CYC_U7; ports BUTTON_BK=CYC/ST LED_IN=LED_IN LED_OUT=LED_IN
Jog3K Host Module/FHL: designators C12=FHL_C12 C14=FHL_C14 R14=FHL_R14 SW3=FHL_SW3 U7=FHL_U7; ports BUTTON_BK=FEED/HOLD LED_IN=LED_IN LED_OUT=LED_IN
Jog3K Host Module/HLT: designators C12=HLT_C12 C14=HLT_C14 R14=HLT_R14 SW3=HLT_SW3 U7=HLT_U7; ports BUTTON_BK=HALT LED_IN=LED_IN LED_OUT=LED_IN

### Notes on the sheet
- PushButton
- SHEET
- Expatria Technologies
- 1136 Glade Court
- Port Coquitlam, BC V3B 1R5
- PROJECT
- SIZE
- ENGR
- MODIFIED
- DOCUMENT
- REV
- Copyright Expatria Technologies 2021.  This document describes Open Hardware and is licensed under the CERN-OHL-P  v2.  No warranty is implied or expressed.
- EMAIL: INFO@EXPATRIA.CA
- B
- /

### Library data of the parts
C12 = 0603 1uF (105) 10% 50V: as C21 on sheet I2C_Jog_Controller; ComponentLink1Description: Supplier link; ComponentLink1URL: http://www.szlcsc.com/product/details_16531.html; Package: 0603; Supplier: LC; SuppliersPartNumber: C15849; Capacitance: 1uF
C14 = 0603 100nF (104) 10% 50V: as C1 on sheet I2C_Jog_Controller; ComponentLink1Description: Supplier link; ComponentLink1URL: http://www.szlcsc.com/product/details_15331.html; Package: 0603; Supplier: LC; SuppliersPartNumber: C14663; Capacitance: 100nF
R14 = 0603 1K (1001) 1%: as R4 on sheet I2C_Jog_Controller; ComponentLink1Description: Supplier link; ComponentLink1URL: http://www.szlcsc.com/product/details_21904.html; Package: 0603; Supplier: LC; SuppliersPartNumber: C21190; Resistance: 1KΩ; Tolerance: 1%
SW3 = CMP-2000-07486-1: as SW3 on sheet PushButtonQuadrant; SuppliersPartNumber: C127509; Package: SMD-4_6.0x6.0x4.5P
U7 = CMP-2000-05026-1: as U1 on sheet I2C_Jog_Controller; Package Description: 4-Pin Surface Mount Device, Body 5 x 5 mm; SuppliersPartNumber: C2874885; Part_Number: WS2812B-B/W

## Sheet 12mm_rotary_knob.SchDoc: Jog3K
size B; DocumentNumber: 5; SheetNumber: 5; SheetTotal: 6
Used 2 times, as channels Jog3K Host Module/SOVR, Jog3K Host Module/FOVR. Parts and nets are listed once, with the designators drawn on the sheet.
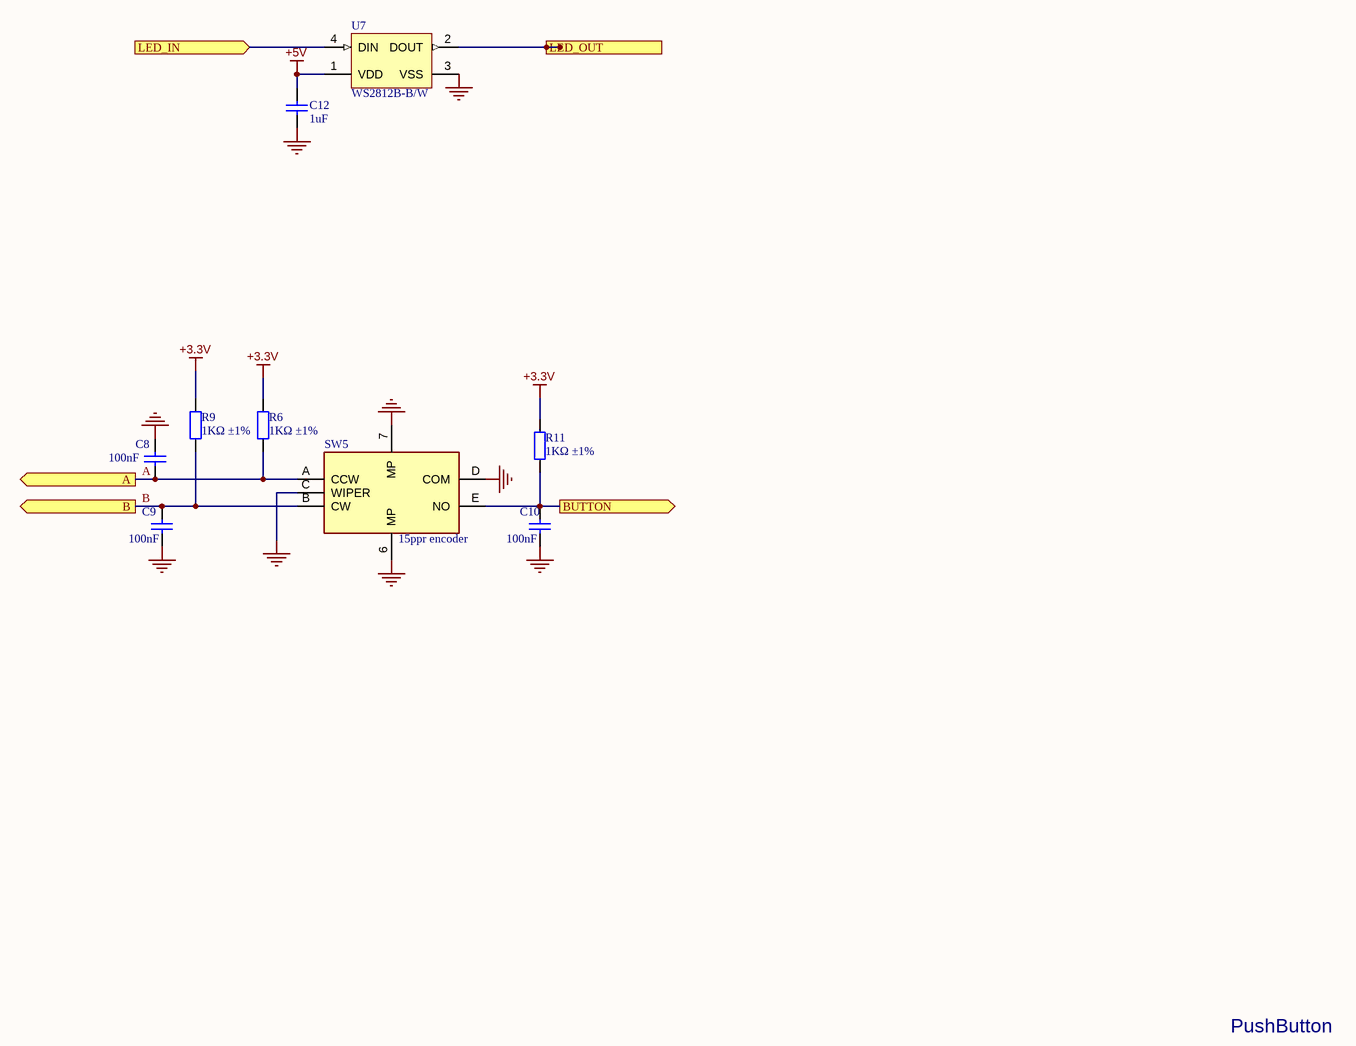
[diagram p7: 12mm_rotary_knob.SchDoc]

### Parts
C8  100nF  [0603_C]
C9  100nF  [0603_C]
C10  100nF  [0603_C]
C12  1uF  [0603_C]
R6  1KΩ ±1%  [0603_R]
R9  1KΩ ±1%  [0603_R]
R11  1KΩ ±1%  [0603_R]
SW5  15ppr encoder  [SW-TH_EC11E15244G1]
U7  WS2812B-B/W  [ADA-RGB-1655_V]

### Ports
A (out), B (out), BUTTON (out), LED_IN (in), LED_OUT (out)

### Nets
+3.3V: R6.1 R9.1 R11.1
+5V: C12.2 U7.1(VDD)
GND: C8.2 C9.1 C10.1 C12.1 SW5.6(MP) SW5.7(MP) SW5.C(WIPER) SW5.D(COM) U7.3(VSS)
A: C8.1 R6.2 SW5.A(CCW) ; port A
B: C9.2 R9.2 SW5.B(CW) ; port B
BUTTON: C10.2 R11.2 SW5.E(NO) ; port BUTTON
LED_IN: U7.4(DIN) ; port LED_IN
LED_OUT: U7.2(DOUT) ; port LED_OUT

### Channels
Jog3K Host Module/SOVR: designators C8=SOVR_C8 C9=SOVR_C9 C10=SOVR_C10 C12=SOVR_C12 R6=SOVR_R6 R9=SOVR_R9 R11=SOVR_R11 SW5=SOVR_SW5 U7=SOVR_U7; ports A=A_SPINOVER B=B_SPINOVER BUTTON=SW_SPINOVER LED_IN=LED_IN LED_OUT=LED_IN
Jog3K Host Module/FOVR: designators C8=FOVR_C8 C9=FOVR_C9 C10=FOVR_C10 C12=FOVR_C12 R6=FOVR_R6 R9=FOVR_R9 R11=FOVR_R11 SW5=FOVR_SW5 U7=FOVR_U7; ports A=A_FEEDOVER B=B_FEEDOVER BUTTON=SW_FEEDOVER LED_IN=LED_IN LED_OUT=LED_OUT_FOVR

### Notes on the sheet
- PushButton
- SHEET
- Expatria Technologies
- 1136 Glade Court
- Port Coquitlam, BC V3B 1R5
- PROJECT
- SIZE
- ENGR
- MODIFIED
- DOCUMENT
- REV
- Copyright Expatria Technologies 2021.  This document describes Open Hardware and is licensed under the CERN-OHL-P  v2.  No warranty is implied or expressed.
- EMAIL: INFO@EXPATRIA.CA
- B
- /

### Library data of the parts
C8-C10 = 0603 100nF (104) 10% 50V: as C1 on sheet I2C_Jog_Controller; ComponentLink1Description: Supplier link; ComponentLink1URL: http://www.szlcsc.com/product/details_15331.html; Package: 0603; Supplier: LC; SuppliersPartNumber: C14663; Capacitance: 100nF
C12 = 0603 1uF (105) 10% 50V: as C21 on sheet I2C_Jog_Controller; ComponentLink1Description: Supplier link; ComponentLink1URL: http://www.szlcsc.com/product/details_16531.html; Package: 0603; Supplier: LC; SuppliersPartNumber: C15849; Capacitance: 1uF
R6 R9 R11 = 0603 1K (1001) 1%: as R4 on sheet I2C_Jog_Controller; ComponentLink1Description: Supplier link; ComponentLink1URL: http://www.szlcsc.com/product/details_21904.html; Package: 0603; Supplier: LC; SuppliersPartNumber: C21190; Resistance: 1KΩ; Tolerance: 1%
SW5 = EC11E15244G1: Plugin Rotary Encoders ROHS 11mm; Manufacturer_Name: ALPSALPINE; Height: 14mm; Manufacturer_Part_Number: EC11E15244G1; Supplier: LCSD; SuppliersPartNumber: C370970
U7 = CMP-2000-05026-1: as U1 on sheet I2C_Jog_Controller; Package Description: 4-Pin Surface Mount Device, Body 5 x 5 mm; SuppliersPartNumber: C2874885; Part_Number: WS2812B-B/W

## Nets that join several sheets
+3.3V: I2C_Jog_Controller (26 pins), Jog3K Host Module/SL1 (SL1_R14.1), Jog3K Host Module/LT (LT_R14.1), Jog3K Host Module/SL2 (SL2_R14.1), Jog3K Host Module/UP (UP_R14.1), Jog3K Host Module/DN (DN_R14.1), Jog3K Host Module/RT (RT_R14.1), Jog3K Host Module/RI (RI_R14.1), Jog3K Host Module/LW (LW_R14.1), Jog3K Host Module/SPN (SPN_R14.1), Jog3K Host Module/HME (HME_R14.1), Jog3K Host Module/SOVR (SOVR_R6.1 SOVR_R9.1 SOVR_R11.1), Jog3K Host Module/FOVR (FOVR_R6.1 FOVR_R9.1 FOVR_R11.1), Jog3K Host Module/FLD (FLD_R14.1), Jog3K Host Module/MST (MST_R14.1), Jog3K Host Module/CYC (CYC_R14.1), Jog3K Host Module/FHL (FHL_R14.1), Jog3K Host Module/HLT (HLT_R14.1)
+5V: I2C_Jog_Controller (7 pins), Jog3K Host Module/LT (LT_C12.2 LT_U7.1), Jog3K Host Module/UP (UP_C12.2 UP_U7.1), Jog3K Host Module/DN (DN_C12.2 DN_U7.1), Jog3K Host Module/RT (RT_C12.2 RT_U7.1), Jog3K Host Module/RI (RI_C12.2 RI_U7.1), Jog3K Host Module/LW (LW_C12.2 LW_U7.1), Jog3K Host Module/SPN (SPN_C12.2 SPN_U7.1), Jog3K Host Module/HME (HME_C12.2 HME_U7.1), Jog3K Host Module/SOVR (SOVR_C12.2 SOVR_U7.1), Jog3K Host Module/FOVR (FOVR_C12.2 FOVR_U7.1), Jog3K Host Module/FLD (FLD_C12.2 FLD_U7.1), Jog3K Host Module/MST (MST_C12.2 MST_U7.1), Jog3K Host Module/CYC (CYC_C12.2 CYC_U7.1), Jog3K Host Module/FHL (FHL_C12.2 FHL_U7.1), Jog3K Host Module/HLT (HLT_C12.2 HLT_U7.1)
GND: I2C_Jog_Controller (50 pins), Jog3K Host Module/SL1 (SL1_C14.2 SL1_SW6.1 SL1_SW6.3 SL1_SW6.4), Jog3K Host Module/LT (5 pins), Jog3K Host Module/SL2 (SL2_C14.2 SL2_SW6.1 SL2_SW6.3 SL2_SW6.4), Jog3K Host Module/UP (5 pins), Jog3K Host Module/DN (5 pins), Jog3K Host Module/RT (5 pins), Jog3K Host Module/RI (5 pins), Jog3K Host Module/LW (5 pins), Jog3K Host Module/SPN (5 pins), Jog3K Host Module/HME (5 pins), Jog3K Host Module/SOVR (9 pins), Jog3K Host Module/FOVR (9 pins), Jog3K Host Module/FLD (5 pins), Jog3K Host Module/MST (5 pins), Jog3K Host Module/CYC (5 pins), Jog3K Host Module/FHL (5 pins), Jog3K Host Module/HLT (5 pins)
A_FEEDOVER: I2C_Jog_Controller (U10.12), Jog3K Host Module/FOVR (FOVR_C8.1 FOVR_R6.2 FOVR_SW5.A)
A_SPINOVER: I2C_Jog_Controller (U10.38), Jog3K Host Module/SOVR (SOVR_C8.1 SOVR_R6.2 SOVR_SW5.A)
B_FEEDOVER: I2C_Jog_Controller (U10.11), Jog3K Host Module/FOVR (FOVR_C9.2 FOVR_R9.2 FOVR_SW5.B)
B_SPINOVER: I2C_Jog_Controller (U10.37), Jog3K Host Module/SOVR (SOVR_C9.2 SOVR_R9.2 SOVR_SW5.B)
CYC/ST: I2C_Jog_Controller (U10.17), Jog3K Host Module/CYC (CYC_C14.1 CYC_R14.2 CYC_SW3.3 CYC_SW3.4)
DOWN: I2C_Jog_Controller (U10.3), Jog3K Host Module/DN (DN_C14.1 DN_R14.2 DN_SW3.3 DN_SW3.4)
FEED/HOLD: I2C_Jog_Controller (U10.15), Jog3K Host Module/FHL (FHL_C14.1 FHL_R14.2 FHL_SW3.3 FHL_SW3.4)
FLOOD: I2C_Jog_Controller (U10.18), Jog3K Host Module/FLD (FLD_C14.1 FLD_R14.2 FLD_SW3.3 FLD_SW3.4)
HALT: I2C_Jog_Controller (U2.2 U10.16), Jog3K Host Module/HLT (HLT_C14.1 HLT_R14.2 HLT_SW3.3 HLT_SW3.4)
HOME: I2C_Jog_Controller (U10.40), Jog3K Host Module/HME (HME_C14.1 HME_R14.2 HME_SW3.3 HME_SW3.4)
JOG/SEL: I2C_Jog_Controller (U10.36), Jog3K Host Module/SL1 (SL1_C14.1 SL1_R14.2 SL1_SW6.2)
JOG/SEL2: I2C_Jog_Controller (U10.9), Jog3K Host Module/SL2 (SL2_C14.1 SL2_R14.2 SL2_SW6.2)
LED_IN: I2C_Jog_Controller (U1.2), Jog3K Host Module/UP (UP_U7.4)
LED_IN: Jog3K Host Module/LT (LT_U7.2), Jog3K Host Module/DN (DN_U7.4)
LED_IN: Jog3K Host Module/LT (LT_U7.4), Jog3K Host Module/UP (UP_U7.2)
LED_IN: Jog3K Host Module/DN (DN_U7.2), Jog3K Host Module/LW (LW_U7.4)
LED_IN: Jog3K Host Module/RT (RT_U7.2), Jog3K Host Module/RI (RI_U7.4)
LED_IN: Jog3K Host Module/RT (RT_U7.4), Jog3K Host Module/LW (LW_U7.2)
LED_IN: Jog3K Host Module/RI (RI_U7.2), Jog3K Host Module/SOVR (SOVR_U7.4)
LED_IN: Jog3K Host Module/SPN (SPN_U7.2), Jog3K Host Module/MST (MST_U7.4)
LED_IN: Jog3K Host Module/SPN (SPN_U7.4), Jog3K Host Module/SOVR (SOVR_U7.2)
LED_IN: Jog3K Host Module/HME (HME_U7.2), Jog3K Host Module/FOVR (FOVR_U7.4)
LED_IN: Jog3K Host Module/HME (HME_U7.4), Jog3K Host Module/FLD (FLD_U7.2)
LED_IN: Jog3K Host Module/FLD (FLD_U7.4), Jog3K Host Module/CYC (CYC_U7.2)
LED_IN: Jog3K Host Module/MST (MST_U7.2), Jog3K Host Module/FHL (FHL_U7.4)
LED_IN: Jog3K Host Module/CYC (CYC_U7.4), Jog3K Host Module/HLT (HLT_U7.2)
LED_IN: Jog3K Host Module/FHL (FHL_U7.2), Jog3K Host Module/HLT (HLT_U7.4)
LEFT: I2C_Jog_Controller (U10.41), Jog3K Host Module/LT (LT_C14.1 LT_R14.2 LT_SW3.3 LT_SW3.4)
LOWER: I2C_Jog_Controller (U10.6), Jog3K Host Module/LW (LW_C14.1 LW_R14.2 LW_SW3.3 LW_SW3.4)
MIST: I2C_Jog_Controller (U10.14), Jog3K Host Module/MST (MST_C14.1 MST_R14.2 MST_SW3.3 MST_SW3.4)
RAISE: I2C_Jog_Controller (U10.7), Jog3K Host Module/RI (RI_C14.1 RI_R14.2 RI_SW3.3 RI_SW3.4)
RIGHT: I2C_Jog_Controller (U10.5), Jog3K Host Module/RT (RT_C14.1 RT_R14.2 RT_SW3.3 RT_SW3.4)
SPINDLE: I2C_Jog_Controller (U10.8), Jog3K Host Module/SPN (SPN_C14.1 SPN_R14.2 SPN_SW3.3 SPN_SW3.4)
SW_FEEDOVER: I2C_Jog_Controller (U10.13), Jog3K Host Module/FOVR (FOVR_C10.2 FOVR_R11.2 FOVR_SW5.E)
SW_SPINOVER: I2C_Jog_Controller (U10.39), Jog3K Host Module/SOVR (SOVR_C10.2 SOVR_R11.2 SOVR_SW5.E)
UP: I2C_Jog_Controller (U10.4), Jog3K Host Module/UP (UP_C14.1 UP_R14.2 UP_SW3.3 UP_SW3.4)

## Assembly variants
FULL_ASSEMBLY: not fitted DN_SW3 J1 LT_SW3 P1 P1 Q2 RT_SW3 UP_SW3